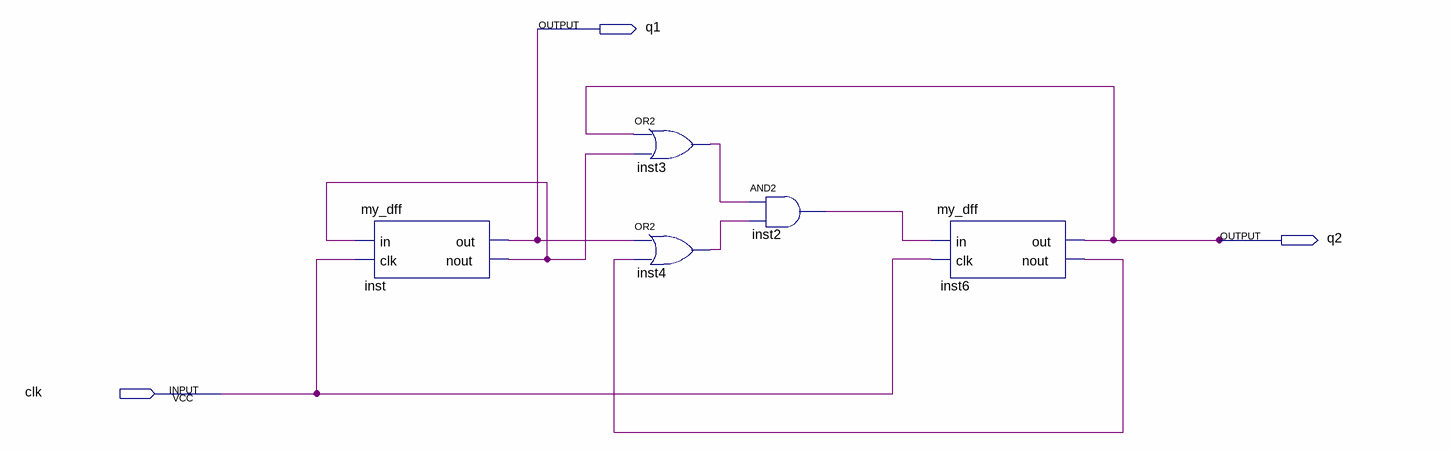
[diagram p0: schematic sheet]
// Quartus schematic count_mod4.bdf as structural Verilog: 5 symbols, 3 pins
module count_mod4 (
  input  clk,
  output q1,
  output q2
);

  wire inst2_out, inst3_out, inst4_out, inst6_nout, inst_nout;

  my_dff inst (.in(inst_nout), .clk(clk), .out(q1), .nout(inst_nout));
  or inst3 (inst3_out, q2, inst_nout);
  or inst4 (inst4_out, q1, inst6_nout);
  and inst2 (inst2_out, inst3_out, inst4_out);
  my_dff inst6 (.in(inst2_out), .clk(clk), .out(q2), .nout(inst6_nout));
endmodule
